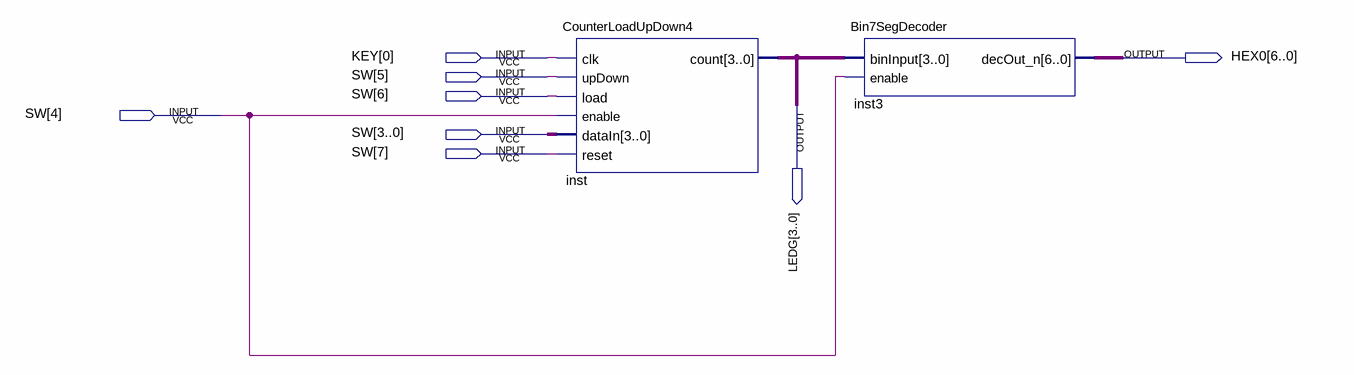
[diagram p0: schematic sheet]
// Quartus schematic Counter_Demo.bdf as structural Verilog: 2 symbols, 8 pins
module Counter_Demo (
  input  [0:0] KEY,
  input  [7:0] SW,
  output [6:0] HEX0,
  output [3:0] LEDG
);

  CounterLoadUpDown4 inst (
    .clk(KEY[0]), .upDown(SW[5]), .load(SW[6]), .enable(SW[4]), .dataIn(SW[3:0]), .reset(SW[7]), .count(LEDG));
  Bin7SegDecoder inst3 (.binInput(LEDG), .enable(SW[4]), .decOut_n(HEX0));
endmodule
